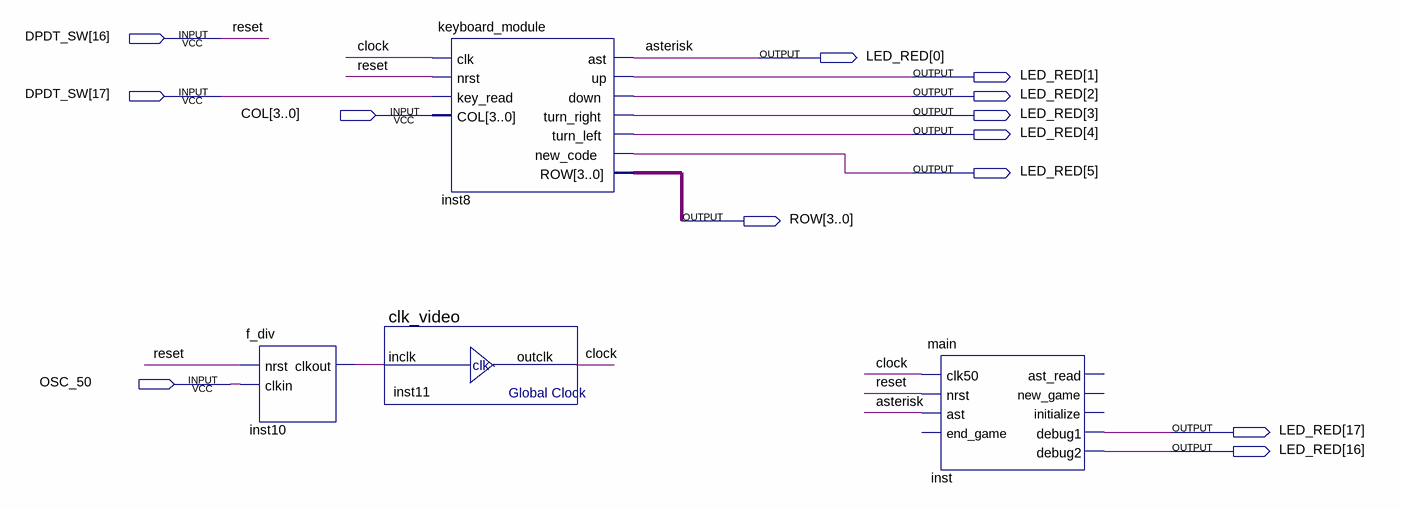
[diagram p0: schematic sheet]
// Quartus schematic debugant_teclat.bdf as structural Verilog: 4 symbols, 13 pins
module debugant_teclat (
  input  [17:16] DPDT_SW,
  input  [3:0] COL,
  input  OSC_50,
  output [17:0] LED_RED,
  output [3:0] ROW
);

  wire clock, inst10_clkout;

  f_div inst10 (.nrst(DPDT_SW[16]), .clkin(OSC_50), .clkout(inst10_clkout));
  clk_video inst11 (.inclk(inst10_clkout), .outclk(clock));
  keyboard_module inst8 (
    .clk(clock), .nrst(DPDT_SW[16]), .key_read(DPDT_SW[17]), .COL(COL), .ast(LED_RED[0]), .up(LED_RED[1]),
    .down(LED_RED[2]), .turn_right(LED_RED[3]), .turn_left(LED_RED[4]), .new_code(LED_RED[5]), .ROW(ROW));
  main inst (
    .clk50(clock), .nrst(DPDT_SW[16]), .ast(LED_RED[0]), .debug1(LED_RED[17]), .debug2(LED_RED[16]));  // open: end_game, ast_read, new_game, initialize

  // Other names for the same wires on the sheet: asterisk = LED_RED[0]; reset = DPDT_SW[16]
endmodule
